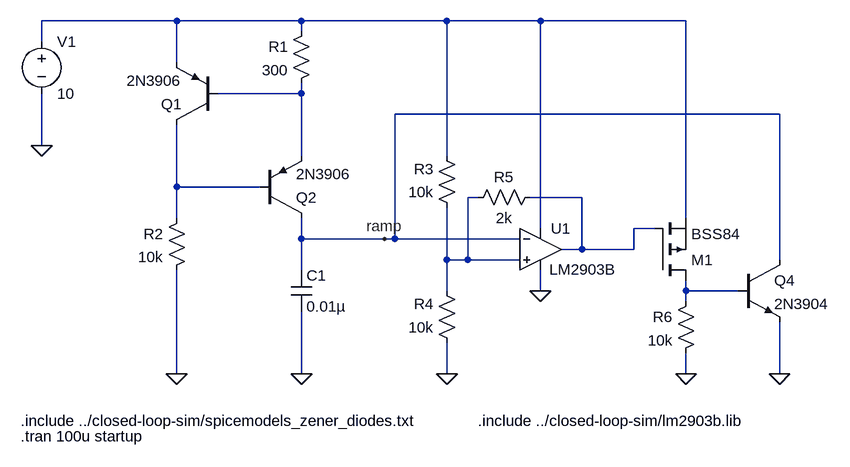
[diagram p0: schematic ramp-gen.asc]
ramp-gen.asc, the LTspice schematic file:
Version 4
SHEET 1 1032 680
WIRE 16 -80 -192 -80
WIRE 208 -80 16 -80
WIRE 432 -80 208 -80
WIRE 576 -80 432 -80
WIRE 800 -80 576 -80
WIRE 208 -64 208 -80
WIRE -192 -48 -192 -80
WIRE 16 -16 16 -80
WIRE 208 32 208 16
WIRE 208 32 80 32
WIRE 944 64 352 64
WIRE -192 112 -192 32
WIRE 208 128 208 32
WIRE 432 128 432 -80
WIRE 16 176 16 80
WIRE 144 176 16 176
WIRE 480 192 464 192
WIRE 640 192 560 192
WIRE 16 224 16 176
WIRE 800 224 800 -80
WIRE 576 240 576 -80
WIRE 752 240 720 240
WIRE 208 256 208 224
WIRE 336 256 208 256
WIRE 352 256 352 64
WIRE 352 256 336 256
WIRE 544 256 352 256
WIRE 640 272 640 192
WIRE 640 272 608 272
WIRE 720 272 720 240
WIRE 720 272 640 272
WIRE 432 288 432 208
WIRE 464 288 464 192
WIRE 464 288 432 288
WIRE 544 288 464 288
WIRE 944 288 944 64
WIRE 208 304 208 256
WIRE 432 336 432 288
WIRE 576 336 576 304
WIRE 800 336 800 320
WIRE 880 336 800 336
WIRE 800 352 800 336
WIRE 16 464 16 304
WIRE 208 464 208 368
WIRE 432 464 432 416
WIRE 800 464 800 432
WIRE 944 464 944 384
FLAG -192 112 0
FLAG 16 464 0
FLAG 208 464 0
FLAG 336 256 ramp
FLAG 432 464 0
FLAG 576 336 0
FLAG 800 464 0
FLAG 944 464 0
SYMBOL pnp 80 80 R180
SYMATTR InstName Q1
SYMATTR Value 2N3906
SYMBOL pnp 144 224 M180
SYMATTR InstName Q2
SYMATTR Value 2N3906
SYMBOL res 224 -80 M0
SYMATTR InstName R1
SYMATTR Value 300
SYMBOL voltage -192 -64 R0
WINDOW 123 0 0 Left 0
WINDOW 39 0 0 Left 0
SYMATTR InstName V1
SYMATTR Value 10
SYMBOL res 32 208 M0
SYMATTR InstName R2
SYMATTR Value 10k
SYMBOL cap 192 304 R0
SYMATTR InstName C1
SYMATTR Value 0.01µ
SYMBOL res 448 224 R180
WINDOW 0 36 76 Left 2
WINDOW 3 36 40 Left 2
SYMATTR InstName R3
SYMATTR Value 10k
SYMBOL res 448 432 R180
WINDOW 0 36 76 Left 2
WINDOW 3 36 40 Left 2
SYMATTR InstName R4
SYMATTR Value 10k
SYMBOL res 576 176 R90
WINDOW 0 0 56 VBottom 2
WINDOW 3 32 56 VTop 2
SYMATTR InstName R5
SYMATTR Value 2k
SYMBOL res 816 336 M0
SYMATTR InstName R6
SYMATTR Value 10k
SYMBOL npn 880 288 R0
SYMATTR InstName Q4
SYMATTR Value 2N3904
SYMBOL OpAmps\\opamp2 576 208 R0
WINDOW 3 14 95 Left 2
SYMATTR InstName U1
SYMATTR Value LM2903B
SYMBOL pmos 752 320 M180
SYMATTR InstName M1
SYMATTR Value BSS84
TEXT -224 560 Left 2 !.tran 100u startup
TEXT -224 536 Left 2 !.include ../closed-loop-sim/spicemodels_zener_diodes.txt
TEXT 480 536 Left 2 !.include ../closed-loop-sim/lm2903b.lib

The netlist it stands for:
* ramp-gen.asc
Q1 N003 N002 N001 0 2N3906
Q2 ramp N003 N002 0 2N3906
R1 N001 N002 300
V1 N001 0 10
R2 N003 0 10k
C1 ramp 0 0.01µ
R3 N004 N001 10k
R4 0 N004 10k
R5 N005 N004 2k
R6 N006 0 10k
Q4 ramp N006 0 0 2N3904
XU1 N004 ramp N001 0 N005 LM2903B  ; pins In+ In- V+ V- OUT
M1 N006 N005 N001 N001 BSS84
.model NPN NPN
.model PNP PNP
.lib standard.bjt
.model NMOS NMOS
.model PMOS PMOS
.lib standard.mos
.tran 100u startup
.include ../closed-loop-sim/spicemodels_zener_diodes.txt
.include ../closed-loop-sim/lm2903b.lib
.backanno
.end